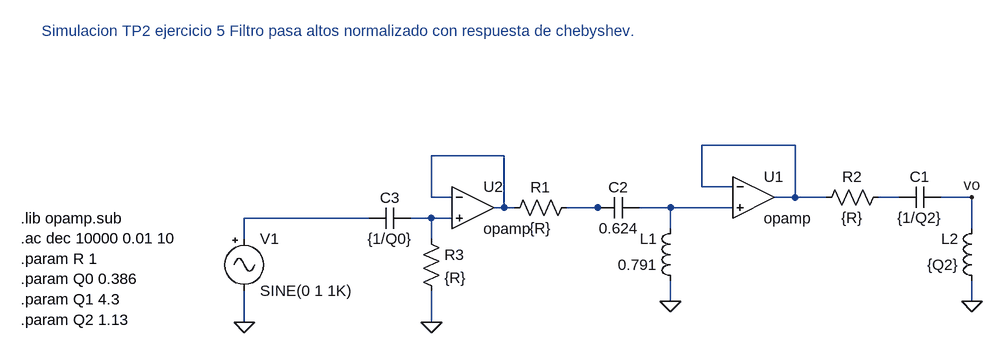
[diagram p0: schematic tp_2_5_normalizado.asc]
tp_2_5_normalizado.asc, the LTspice schematic file:
Version 4
SHEET 1 880 680
WIRE 544 192 400 192
WIRE 96 208 -16 208
WIRE 400 256 400 192
WIRE 448 256 400 256
WIRE -16 272 -16 208
WIRE 16 272 -16 272
WIRE 544 272 544 192
WIRE 544 272 512 272
WIRE 592 272 544 272
WIRE 704 272 672 272
WIRE 816 272 768 272
WIRE 96 288 96 208
WIRE 96 288 80 288
WIRE 112 288 96 288
WIRE 240 288 192 288
WIRE 256 288 240 288
WIRE 352 288 304 288
WIRE 448 288 352 288
WIRE -112 304 -304 304
WIRE -16 304 -48 304
WIRE 16 304 -16 304
WIRE 352 320 352 288
WIRE 816 320 816 272
WIRE -304 336 -304 304
WIRE -16 336 -16 304
WIRE 352 432 352 400
WIRE 816 432 816 400
WIRE -304 464 -304 416
WIRE -16 464 -16 416
FLAG 352 432 0
FLAG 816 432 0
FLAG -304 464 0
FLAG 816 272 vo
FLAG -16 464 0
SYMBOL Opamps/opamp 480 208 R0
SYMATTR InstName U1
SYMBOL res 208 272 R90
WINDOW 0 0 56 VBottom 2
WINDOW 3 32 56 VTop 2
SYMATTR InstName R1
SYMATTR Value {R}
SYMBOL res 688 256 R90
WINDOW 0 0 56 VBottom 2
WINDOW 3 32 56 VTop 2
SYMATTR InstName R2
SYMATTR Value {R}
SYMBOL ind 368 416 R180
WINDOW 0 36 80 Left 2
WINDOW 3 36 40 Left 2
SYMATTR InstName L1
SYMATTR Value 0.791
SYMBOL ind 832 416 R180
WINDOW 0 36 80 Left 2
WINDOW 3 36 40 Left 2
SYMATTR InstName L2
SYMATTR Value {Q2}
SYMBOL cap 768 256 R90
WINDOW 0 0 32 VBottom 2
WINDOW 3 32 32 VTop 2
SYMATTR InstName C1
SYMATTR Value {1/Q2}
SYMBOL cap 304 272 R90
WINDOW 0 0 32 VBottom 2
WINDOW 3 32 32 VTop 2
SYMATTR InstName C2
SYMATTR Value 0.624
SYMBOL Misc/signal -304 320 R0
SYMATTR InstName V1
SYMATTR Value2 AC 1
SYMBOL Opamps/opamp 48 224 R0
SYMATTR InstName U2
SYMBOL cap -48 288 R90
WINDOW 0 0 32 VBottom 2
WINDOW 3 32 32 VTop 2
SYMATTR InstName C3
SYMATTR Value {1/Q0}
SYMBOL res -32 320 R0
SYMATTR InstName R3
SYMATTR Value {R}
TEXT -648 304 Left 2 !.lib opamp.sub\n.ac dec 10000 0.01 10\n.param R 1\n.param Q0 0.386\n.param Q1 4.3 \n.param Q2 1.13
TEXT -616 16 Left 2 ;Simulacion TP2 ejercicio 5 Filtro pasa altos normalizado con respuesta de chebyshev.

The netlist it stands for:
* tp_2_5_normalizado.asc
XU1 N001 N005 N001 opamp Aol=100K GBW=10Meg  ; pins invin noninvin out
R1 N004 N002 {R}
R2 N003 N001 {R}
L1 0 N005 0.791
L2 0 vo {Q2}
C1 vo N003 {1/Q2}
C2 N005 N004 0.624
V1 N006 0 SINE(0 1 1K) AC 1
XU2 N002 N007 N002 opamp Aol=100K GBW=10Meg  ; pins invin noninvin out
C3 N007 N006 {1/Q0}
R3 N007 0 {R}
.lib opamp.sub
.ac dec 10000 0.01 10
.param R 1
.param Q0 0.386
.param Q1 4.3
.param Q2 1.13
* Simulacion TP2 ejercicio 5 Filtro pasa altos normalizado con respuesta de chebyshev.
.backanno
.end